# Altium schematic sheet 09 usb device port.SchDoc
size A3; SheetNumber: 13; SheetTotal: 16
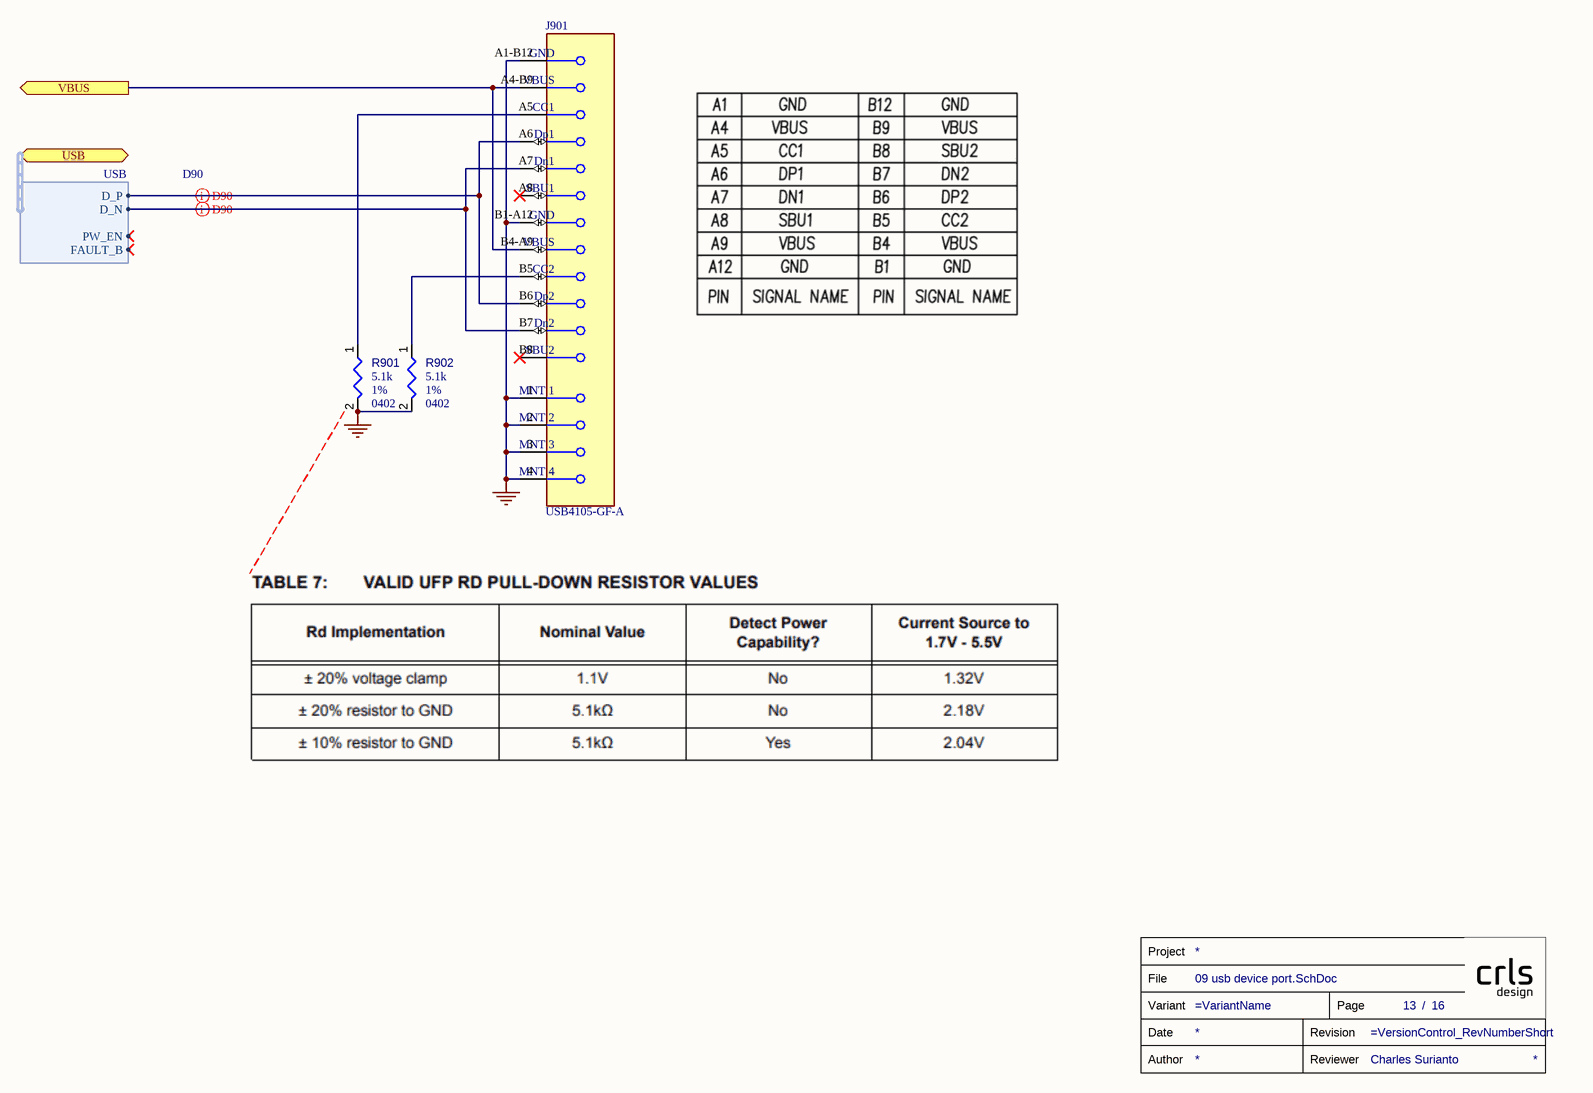
[diagram p0: 09 usb device port.SchDoc]

## Parts
J901  USB4105-GF-A  [FP-USB4105-GF-A-MFG]
R901  value 5.1k  Case/Package: 0402  Tolerance: 1%  [RESC0402(1005)_L]  (hidden comment: Resistors,0402,1%,5.1k)
R902  value 5.1k  Case/Package: 0402  Tolerance: 1%  [RESC0402(1005)_L]  (hidden comment: Resistors,0402,1%,5.1k)
TB?  Reviewer: Charles Surianto  (hidden comment: TITLE_BLOCK)  (graphical)

## Ports
USB (bidir, harness USB), VBUS (out)

## Harnesses
USB: D_P, D_N, PW_EN, FAULT_B

## Nets
GND: J901.1(MNT_1) J901.2(MNT_2) J901.3(MNT_3) J901.4(MNT_4) J901.A1-B12(GND) J901.B1-A12(GND) R901.2 R902.2
VBUS: J901.A4-B9(VBUS) J901.B4-A9(VBUS) ; port VBUS
NetJ901_A5: J901.A5(CC1) R901.1
NetJ901_A6: J901.A6(Dp1) J901.B6(Dp2) ; port USB.D_P
NetJ901_A7: J901.A7(Dn1) J901.B7(Dn2) ; port USB.D_N
NetJ901_B5: J901.B5(CC2) R902.1

Not connected (* = marked no-connect by the designer): J901 A8(SBU1)* B8(SBU2)*

## Layout directives
differential pair; differential pair class D90: NetJ901_A6, NetJ901_A7

## Notes on the sheet
- (in symbol TITLE_BLOCK) Project; File; Variant; Page; /; Date; Revision; Author; Reviewer

## Library data of the parts
J901 = CMP-245163-000001-1: CONN RCPT USB2.0 TYPEC 5A; Manufacturer: GCT; Voltage Rating: 20V; Is Female: yes; Current Rating: 5/6.25/1.25/0.25A; Number Of Contacts: 16; Conn Orientation: Right Angle; Device Class L1: Connectors; Category: Conn; Lead Free: Yes; RoHS: TRUE; Temperature Range High: +85°C; Digikey Description: CONN RCPT USB2.0 TYPEC 5A; Device Class L3: unset; ComponentLink2Description: Datasheet; Manufacturer Part Number: USB4105-GF-A; Package: 0; Usb Standard: USB 2.0; Device Class L2: USB Connectors; Automotive: No; Temperature Range Low: -40°C; Height: 3.46mm; Temperature: -40°C to +85°C; Contact Material: Gold,Nickel; ComponentLink2URL: https://gct.co/files/drawings/usb4105.pdf; Octopart: https://octopart.com/usb4105-gf-a-gct-106627878
R901 R902 = Resistors: Resistor; Component Type: Resistors
TB? = TITLE_BLOCK: Review Date: *